# Altium schematic sheet Sheet2.SchDoc
size A
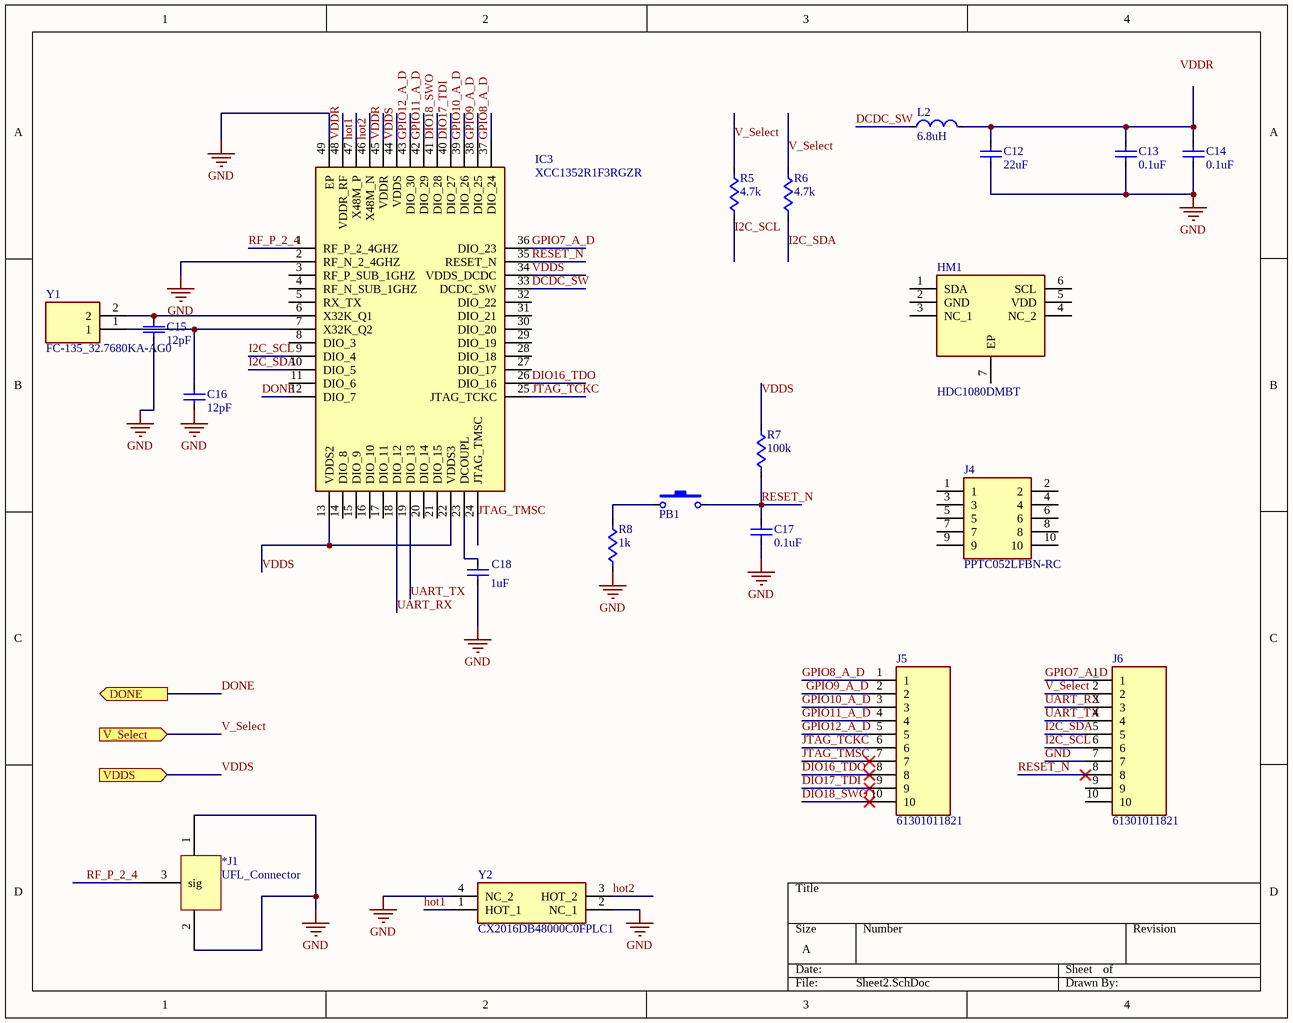
[diagram p0: Sheet2.SchDoc]

## Parts
*J1  UFL_Connector  [UFL_Connector]
C12  value 22uF  [PASSIVE-CAPACITOR-0603]
C13  value 0.1uF  [PASSIVE-CAPACITOR-0603]  (hidden comment: Passive-Capacitor (Generic))
C14  value 0.1uF  [PASSIVE-CAPACITOR-0603]  (hidden comment: Passive-Capacitor (Generic))
C15  value 12pF  [PASSIVE-CAPACITOR-0603]  (hidden comment: Passive-Capacitor (Generic))
C16  value 12pF  [PASSIVE-CAPACITOR-0603]  (hidden comment: Passive-Capacitor (Generic))
C17  value 0.1uF  [PASSIVE-CAPACITOR-0603]  (hidden comment: Passive-Capacitor (Generic))
C18  value 1uF  [PASSIVE-CAPACITOR-0603]  (hidden comment: Passive-Capacitor (Generic))
HM1  HDC1080DMBT  [SON100P300X300X80-7N]
IC3  XCC1352R1F3RGZR  [QFN50P700X700X100-49N-D]
J4  PPTC052LFBN-RC  [SHDR10W87P254_2X5_1320X508X870P]
J5  61301011821  [SHDR10W87P0X254_1X10_2590X250X865P]
J6  61301011821  [SHDR10W87P0X254_1X10_2590X250X865P]
L2  value 6.8uH  [PASSIVE-INDUCTOR-0603]  (hidden comment: Passive-Inductor (Generic))
PB1  Interface-Push-Button  [INTERFACE-PUSH-BUTTON]  (value not drawn)
R5  value 4.7k  [PASSIVE-RESISTOR-0603]  (hidden comment: Passive-Resistor (Generic))
R6  value 4.7k  [PASSIVE-RESISTOR-0603]  (hidden comment: Passive-Resistor (Generic))
R7  value 100k  [PASSIVE-RESISTOR-0603]  (hidden comment: Passive-Resistor (Generic))
R8  value 1k  [PASSIVE-RESISTOR-0603]  (hidden comment: Passive-Resistor (Generic))
Y1  FC-135_32.7680KA-AG0  [FC135327680KAAG0]
Y2  CX2016DB48000C0FPLC1  [CX2016DB48000C0FPLC1]

## Ports
DONE (out), V_Select (in), VDDS (in)

## Nets
GND: *J1.1 *J1.2 C12.2 C13.1 C14.1 C15.1 C16.1 C17.2 C18.1 IC3.2(RF_N_2_4GHZ) IC3.49(EP) J6.7 R8.1 Y2.2(NC_1) Y2.4(NC_2)
DCDC_SW: IC3.33(DCDC_SW) L2.1
DIO16_TDO: IC3.26(DIO_16) J5.8
DIO17_TDI: IC3.40(DIO_27) J5.9
DIO18_SWO: IC3.41(DIO_28) J5.10
DONE: IC3.12(DIO_7) ; port DONE
GPIO7_A_D: IC3.36(DIO_23) J6.1
GPIO8_A_D: IC3.37(DIO_24) J5.1
GPIO9_A_D: IC3.38(DIO_25) J5.2
GPIO10_A_D: IC3.39(DIO_26) J5.3
GPIO11_A_D: IC3.42(DIO_29) J5.4
GPIO12_A_D: IC3.43(DIO_30) J5.5
hot1: IC3.47(X48M_P) Y2.1(HOT_1)
hot2: IC3.46(X48M_N) Y2.3(HOT_2)
I2C_SCL: IC3.9(DIO_4) J6.6 R5.1
I2C_SDA: IC3.10(DIO_5) J6.5 R6.1
JTAG_TCKC: IC3.25(JTAG_TCKC) J5.6
JTAG_TMSC: IC3.24(JTAG_TMSC) J5.7
RESET_N: C17.1 IC3.35(RESET_N) J6.8 PB1.2 R7.1
RF_P_2_4: *J1.3(sig) IC3.1(RF_P_2_4GHZ)
UART_RX: IC3.18(DIO_12) J6.3
UART_TX: IC3.19(DIO_13) J6.4
V_Select: J6.2 R5.2 R6.2 ; port V_Select
VDDR: IC3.45(VDDR) IC3.48(VDDR_RF)
VDDS: IC3.13(VDDS2) IC3.22(VDDS3) IC3.34(VDDS_DCDC) IC3.44(VDDS) R7.2 ; port VDDS
NetC12_1: C12.1 C13.2 C14.2 L2.2
NetC15_2: C15.2 IC3.6(X32K_Q1) Y1.2
NetC16_2: C16.2 IC3.7(X32K_Q2) Y1.1
NetC18_2: C18.2 IC3.23(DCOUPL)
NetPB1_1: PB1.1 R8.2

Not connected (* = marked no-connect by the designer): HM1 1(SDA) 2(GND) 3(NC_1) 4(NC_2) 5(VDD) 6(SCL) 7(EP); IC3 3(RF_P_SUB_1GHZ) 4(RF_N_SUB_1GHZ) 5(RX_TX) 8(DIO_3) 11(DIO_6) 14(DIO_8) 15(DIO_9) 16(DIO_10) 17(DIO_11) 20(DIO_14) 21(DIO_15) 27(DIO_17) 28(DIO_18) 29(DIO_19) 30(DIO_20) 31(DIO_21) 32(DIO_22); J4 1 2 3 4 5 6 7 8 9 10; J6 9 10

## Notes on the sheet
- Labels drawn without touching a wire or pin: VDDR

## Library data of the parts
*J1 = UFL_Connector: CONN U.FL RCPT STR 50 OHM SMD
C12-C18 = Passive-Capacitor (Generic): Generic Capacitor; Category: Passive; Manufacturer: *; Manufacturer Part Number: *; Supplier 2: Digi-Key; Package: *; Through Hole (y/n): *; Supplier 1: Mouser; Supplier Part Number 1: *; Supplier Part Number 2: *
HM1 = HDC1080DMBT: Hygrometer; Manufacturer_Name: Texas Instruments; Datasheet Link: http://www.mouser.com/ds/2/405/hdc1080-844688.pdf; Height: 0.8mm; Manufacturer_Part_Number: HDC1080DMBT; Mouser Part Number: 595-HDC1080DMBT; Mouser Price/Stock: https://www.mouser.com/Search/Refine.aspx?Keyword=595-HDC1080DMBT; RS Part Number: 1330170P; RS Price/Stock: http://uk.rs-online.com/web/p/products/1330170P
IC3 = XCC1352R1F3RGZR: Integrated Circuit; Manufacturer_Name: Texas Instruments; Datasheet Link: http://www.ti.com/lit/gpn/cc1352r; Height: 1mm; Manufacturer_Part_Number: XCC1352R1F3RGZR
J4 = PPTC052LFBN-RC: Connector; Manufacturer_Name: Sullins; Datasheet Link: http://www.sullinscorp.com/drawings/78_P(N)PxCxxxLFBN-RC,_10492-H.pdf; Height: 8.7mm; Manufacturer_Part_Number: PPTC052LFBN-RC
J5 J6 = 61301011821: Connector; Manufacturer_Name: Wurth Elektronik; Datasheet Link: http://katalog.we-online.de/em/datasheet/6130xx11821.pdf; Height: 8.65mm; Manufacturer_Part_Number: 61301011821; Mouser Part Number: 710-61301011821; Mouser Price/Stock: https://www.mouser.com/Search/Refine.aspx?Keyword=710-61301011821
L2 = Passive-Inductor (Generic): Generic Inductor; Category: Passive; Manufacturer: *; Supplier 2: Digi-Key; Manufacturer Part Number: *; Supplier 1: Mouser; Package: *; Supplier Part Number 1: *; Supplier Part Number 2: *; Through Hole (y/n): *
PB1 = Interface-Push-Button: 2.5mm Tall, 2.5N Force, Straight, SMD, Push Button; Manufacturer: C&K Components; Manufacturer Part Number: PTS820 J25K SMTR LFS; Value: Single; Through Hole (y/n): N; ComponentLink1Description: Datasheet; ComponentLink1URL: https://www.mouser.com/datasheet/2/60/pts820-1382642.pdf; Category: Interface; Package: SMD-6; Supplier 1: Mouser; Supplier Part Number 1: 611-PTS820J25KSMTR; Supplier 2: Digi-Key; Supplier Part Number 2: CKN10897CT-ND
R5-R8 = Passive-Resistor (Generic): Generic Resistor; Through Hole (y/n): N; Category: Passive; Manufacturer: *; Manufacturer Part Number: *; Package: *; Supplier 1: Mouser; Supplier 2: Digi-Key; Supplier Part Number 1: *; Supplier Part Number 2: *
Y1 = FC-135_32.7680KA-AG0: Crystal or Oscillator; Manufacturer_Name: Epson Timing; Manufacturer_Part_Number: FC-135 32.7680KA-AG0; Datasheet Link: https://support.epson.biz/td/api/doc_check.php?dl=brief_FC-135&lang=en/.pdf; Height: 0mm; Mouser Part Number: 732-FC135-32.76KAAG0; Mouser Price/Stock: https://www.mouser.com/Search/Refine.aspx?Keyword=732-FC135-32.76KAAG0
Y2 = CX2016DB48000C0FPLC1: Crystal or Oscillator; Manufacturer_Name: Kyocera Electronic Components; Datasheet Link: https://componentsearchengine.com/Datasheets/1/CX2016DB48000C0FPLC1.pdf; Manufacturer_Part_Number: CX2016DB48000C0FPLC1; Mouser Part Number: 581-CX2016DB48CFPLC1; Mouser Price/Stock: https://www.mouser.com/Search/Refine.aspx?Keyword=581-CX2016DB48CFPLC1